# EAGLE design Pluvion 2 - vPG (EAGLE 7.6.0)

## Sheet 1 of 3
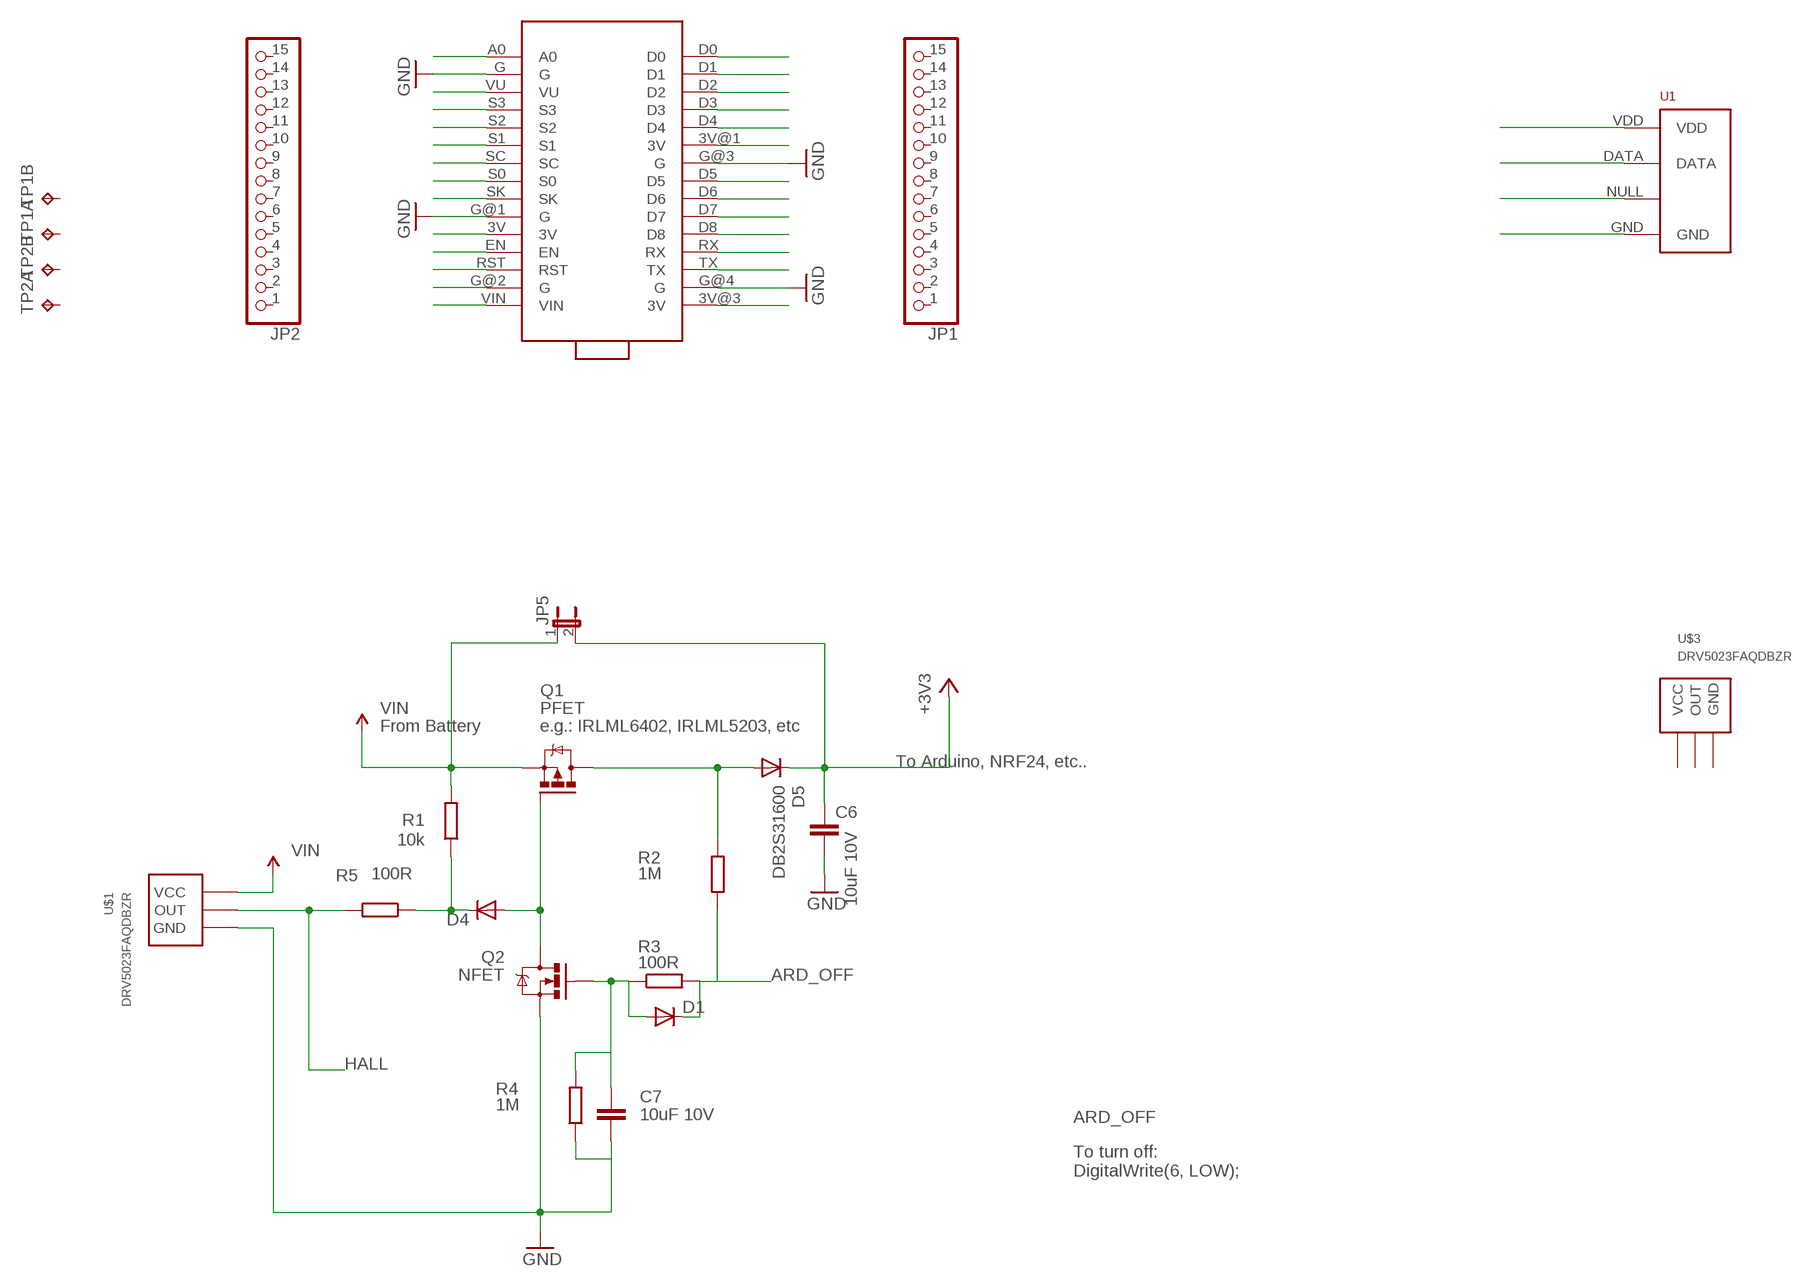
[diagram p0: schematic, sheet 1]

### Parts
C6  10uF 10V  C-EUC0805  [C0805]
C7  10uF 10V  C-EUC0805  [C0805]
D1  DIODESMB  [SMB-DIODE]
D4  DIODESMB  [SMB-DIODE]
D5  DB2S31600  DIODESMB  [SMB-DIODE]
JP1  PINHD-1X15  [1X15]
JP2  PINHD-1X15  [1X15]
JP5  JUMPER-2PTH  [1X02]
Q1  PFET  IRLML5203  [MICRO3]
Q2  NFET  MOSFET-NCHANNELBSS123LT1G  [SOT23]
R1  10k  R-EU_R0805  [R0805]
R2  1M  R-EU_R0805  [R0805]
R3  100R  R-EU_R0805  [R0805]
R4  1M  R-EU_R0805  [R0805]
R5  100R  R-EU_R0805  [R0805]
TP1  TP2P2-38-17  [P2-38-17]
TP2  TP2P2-38-17  [P2-38-17]
U1  RHT03_DHT-22_AM2302RA  [RHT03_DHT-22/RA]
U$1  DRV5023FAQDBZR  [SOT23]
U$2  NODE-LOLIN-ESP8266  [NODE-LOLIN-ESP8266]
U$3  DRV5023FAQDBZR  [SOT23]

### Nets
+3V3: C6.1 D5.C JP5.2
ARD_OFF: D1.C R2.1 R3.2
BUTTONS: D4.A Q1.1(G) Q2.3(D)
GND: C6.2 C7.2 Q2.2(S) R4.1 U$1.3(GND) U$2.G U$2.G@1(G) U$2.G@3(G) U$2.G@4(G)
HALL: R5.2 U$1.2(OUT)
N$1: D5.A Q1.3(D) R2.2
N$2: C7.1 D1.A Q2.1(G) R3.1 R4.2
N$3: U$2.D0
N$4: U$2.D1
N$5: U$2.D2
N$6: U$2.D3
N$7: U$2.D4
N$8: D4.C R1.1 R5.1
N$9: U$2.3V@1(3V)
N$10: U1.VDD
N$11: U$2.D5
N$12: U$2.D6
N$13: U$2.D7
N$14: U$2.D8
N$15: U$2.RX
N$16: U$2.TX
N$17: U1.DATA
N$18: U$2.3V@3(3V)
N$19: U$2.A0
N$20: U1.NULL
N$21: U$2.VU
N$22: U$2.S3
N$23: U$2.S2
N$24: U$2.S1
N$25: U$2.SC
N$26: U$2.S0
N$27: U$2.SK
N$28: U1.GND
N$29: U$2.3V
N$30: U$2.EN
N$31: U$2.RST
N$32: U$2.G@2(G)
N$33: U$2.VIN
VIN: JP5.1 Q1.2(S) R1.2 U$1.1(VCC)
Unconnected: JP1.1 JP1.2 JP1.3 JP1.4 JP1.5 JP1.6 JP1.7 JP1.8 JP1.9 JP1.10 JP1.11 JP1.12 JP1.13 JP1.14 JP1.15 JP2.1 JP2.2 JP2.3 JP2.4 JP2.5 JP2.6 JP2.7 JP2.8 JP2.9 JP2.10 JP2.11 JP2.12 JP2.13 JP2.14 JP2.15 TP1.TP-1 TP1.TP-2 TP2.TP-1 TP2.TP-2 U$3.1(VCC) U$3.2(OUT) U$3.3(GND)

### Notes on the sheet
- From Battery | e.g.: IRLML6402, IRLML5203, etc
- To Arduino, NRF24, etc..
- To turn off:
  DigitalWrite(6, LOW);

## Sheet 2 of 3

## Sheet 3 of 3

## Library data of the parts
C6 C7 = wes:C-EU: CAPACITOR, European symbol
D1 D4 D5 = SparkFun-DiscreteSemi:DIODE: Diode These are standard reverse protection diodes and small signal diodes. SMA package can handle up to about 1A. SOD-323 can handle about 200mA. What the SOD-323 package when ordering, there are some mfgs out there that are 5-pin packages.
JP1 JP2 = pinhead:PINHD-1X15: PIN HEADER
JP5 = SparkFun-Passives:JUMPER-2: Jumper Basic 0.1" spaced jumper. Use with breakaway headers.
Q1 = transistor-power:IRLML5203: HEXFET P-Channel Power MOSFET
Q2 = SparkFun-DiscreteSemi:MOSFET-NCHANNEL: Common NMOSFET Parts MFG P/N Store ID Prod ID FDD8780 TRANS-09984 SI7820DN TRANS-11055 FDS6630A IC-08089 2N7002PW TRANS-11151 FQP30N06L COM-10213 TRANS-10060 BSS123LT1G TRANS-08345 BSS138 TRANS-00830 BS170 2N7000; PROD_ID: TRANS-08345
R1-R5 = wes:R-EU_: RESISTOR, European symbol
TP1 TP2 = testpad:TP2: Test pad
U1 = RHT03_DHT-22_AM2302:RHT03_DHT-22_AM2302: RHT03 / DHT-22 / AM2302 Packages and symbol for the RHT03 / DHT-22 relative humidity and temperature sensor. Note: The AM2302 is a wired version of the DHT-22 which typically requires less clearance and is thus provided as a separate package.; PROD_ID: SEN-10167
U$1 U$3 = lib_pluvion:DRV5023FAQDBZR: Digital Switch Hall Sensor
U$2 = wes:NODE-LOLIN-ESP8266

## Board
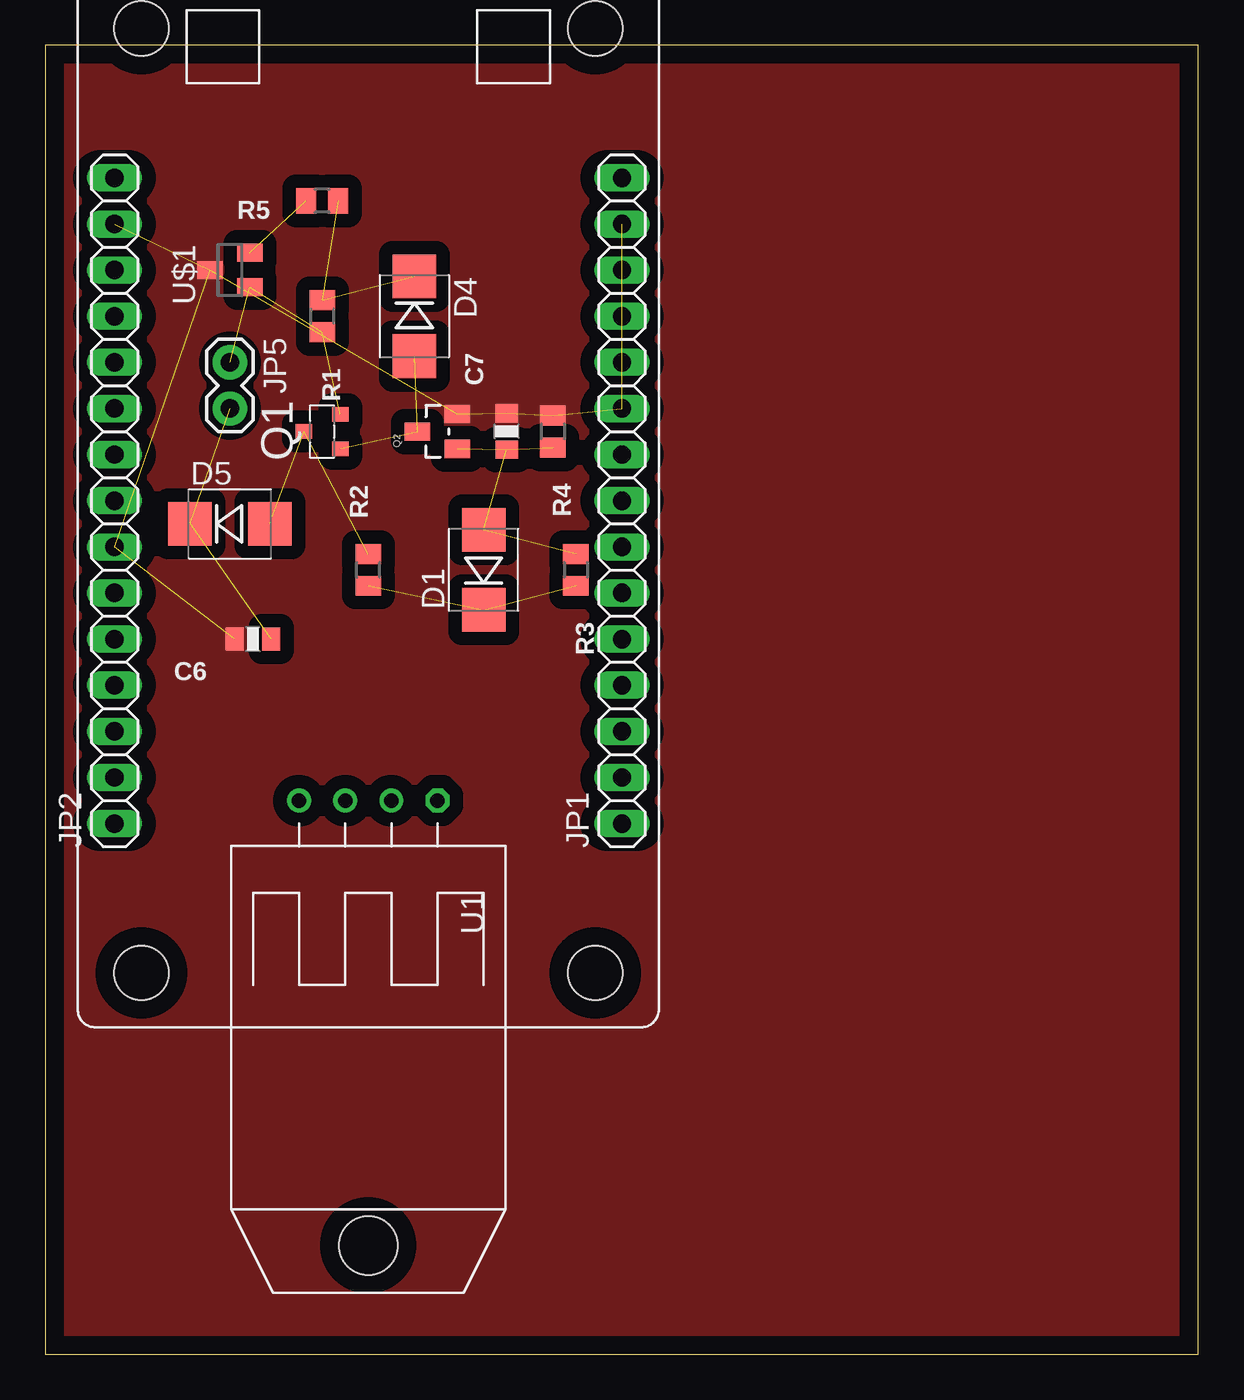
[diagram p1: board, top side]

Size 63.48 x 72.06 mm. Coordinates in mm from the lower left corner, seen from the top.
Outline: 0,0 63.48,0 63.48,72.06 0,72.06 0,0
Copper layers (1*16): Top 0.035mm / dielectric 1.5mm / Bottom 0.035mm
Design rules "default": minimum track width 10mil, minimum drill 0.6mm, track to track 8mil, track to pad 8mil, pad to pad 8mil, via to via 8mil, smd to smd 8mil, copper to edge 40mil, drill to drill 8mil, minimum pad ring 10mil, minimum via ring 8mil, stop-mask expansion 4mil, vias tented up to drill 0mil, thermal gap 10mil

### Footprints (pad centres in the part's own frame; a part is rotated, then mirrored left to right if it is on the bottom)
C0805 = smd 1 x 1.25: 1 -1,0; 2 1,0
SMB-DIODE = smd 2.4 x 2.4: A 2.2,0; C -2.2,0
1X15 = drill 1.016 long: 1 -17.78,0; 2 -15.24,0; 3 -12.7,0; 4 -10.16,0; 5 -7.62,0; 6 -5.08,0; 7 -2.54,0; 8 0,0; 9 2.54,0; 10 5.08,0; 11 7.62,0; 12 10.16,0; 13 12.7,0; 14 15.24,0; 15 17.78,0
1X02 = drill 1.016 pad 1.88: 1 0,0; 2 2.54,0
MICRO3 = smd 0.8 x 0.9: 1 -0.95,-1; 2 0.95,-1; 3 0,1
SOT23 = smd 1 x 1.4: 1 -0.95,-1.1; 2 0.95,-1.1; 3 0,1.1
R0805 = smd 1.1 x 1.4: 1 -0.875,0; 2 0.875,0
P2-38-17 = drill 1.702 pad 2.121 long: TP-1 -1.905,0; TP-2 1.905,0
RHT03_DHT-22/RA = drill 0.8: DATA -1.27,0; GND 3.81,0; NULL 1.27,0 | drill 0.8 octagon: VDD -3.81,0 | hole 3.25: 0,24.5
NODE-LOLIN-ESP8266 = drill 0.8: 3V -13.97,17.78; 3V@1 -13.97,-5.08; 3V@3 13.97,7.62; A0 13.97,-17.78; D0 -13.97,-17.78; D1 -13.97,-15.24; D2 -13.97,-12.7; D3 -13.97,-10.16; D4 -13.97,-7.62; D5 -13.97,0; D6 -13.97,2.54; D7 -13.97,5.08; D8 -13.97,7.62; EN 13.97,10.16; G -13.97,15.24; G@1 -13.97,-2.54; G@2 13.97,-15.24; G@3 13.97,5.08; G@4 13.97,15.24; RST 13.97,12.7; RX -13.97,10.16; S0 13.97,0; S1 13.97,-5.08; S2 13.97,-7.62; S3 13.97,-10.16; SC 13.97,-2.54; SK 13.97,2.54; TX -13.97,12.7; VIN 13.97,17.78; VU 13.97,-12.7 | hole 3: -12.5,26; 12.5,26; -12.5,-26; 12.5,-26

### Placement (x,y rotation side)
C6  11.43,39.37 180 top
C7  25.4,50.8 90 top
D1  24.13,43.18 90 top
D4  20.32,57.15 270 top
D5  10.16,45.72 0 top
JP1  31.75,46.99 90 top
JP2  3.81,46.99 90 top
JP5  10.16,54.61 270 top
Q1  15.24,50.8 90 top
Q2  21.59,50.8 90 top
R1  15.24,57.15 270 top
R2  17.78,43.18 90 top
R3  29.21,43.18 270 top
R4  27.94,50.8 270 top
R5  15.24,63.5 180 top
TP1  -22.86,-25.4 0 top  (outside the outline)
TP2  -22.86,-34.29 0 top  (outside the outline)
U1  17.78,30.48 180 top
U$1  10.16,59.69 90 top
U$2  17.78,46.99 0 top
U$3  -24.13,-16.51 0 top  (outside the outline)

### Tracks (layer width: path | path; a pad name or v marks a point on that pad's centre or on a via)
+3V3  (2 unrouted)
ARD_OFF  (2 unrouted)
BUTTONS  (2 unrouted)
GND  (8 unrouted)
  pour Top (isolate 0.762, no thermals): -10.16,73.66 90.17,73.66 90.17,-12.7 -10.16,-12.7
HALL  (1 unrouted)
N$1  (2 unrouted)
N$2  (4 unrouted)
N$8  (2 unrouted)
VIN  (3 unrouted)